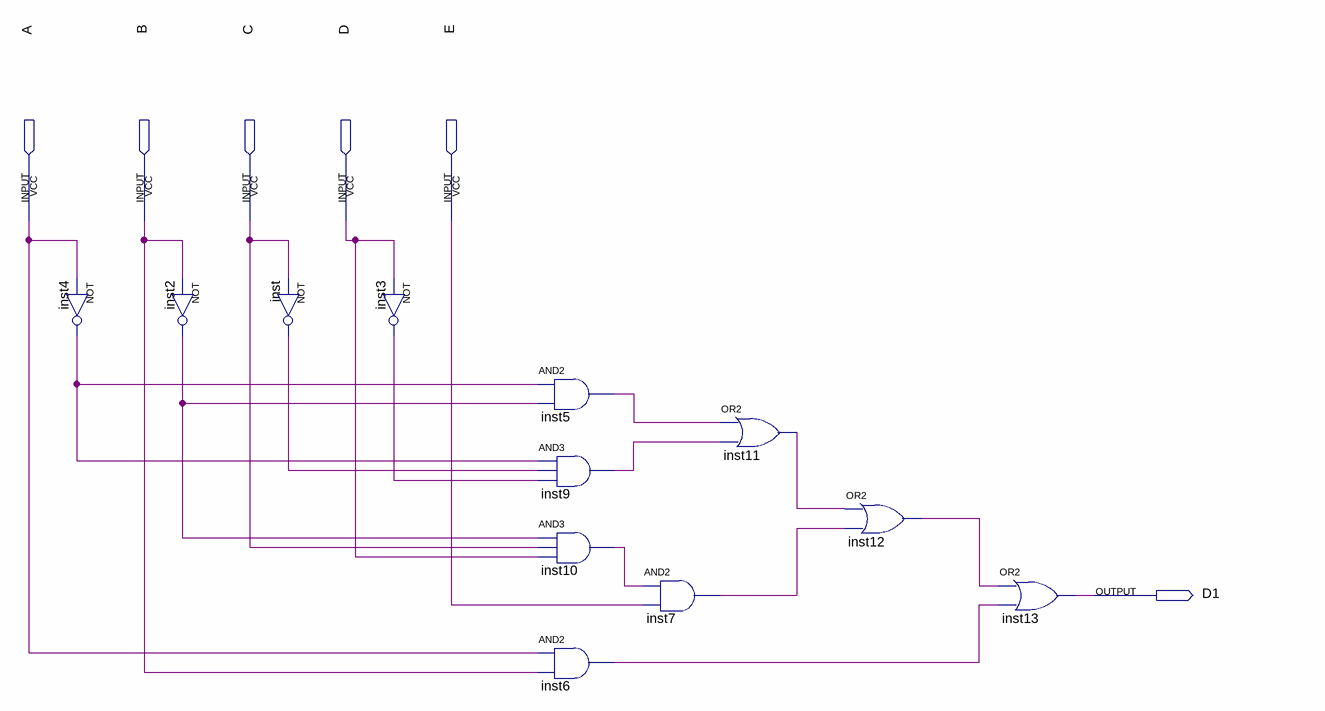
[diagram p0: schematic sheet]
// Quartus schematic led-D1.bdf as structural Verilog: 12 symbols, 6 pins
module \led-D1  (
  input  A,
  input  B,
  input  C,
  input  D,
  input  E,
  output D1
);

  wire inst2_out, inst3_out, inst4_out, inst5_out, inst6_out, inst7_out, inst9_out, inst10_out, inst11_out,
       inst12_out, inst_out;

  not inst4 (inst4_out, A);
  not inst2 (inst2_out, B);
  not inst (inst_out, C);
  not inst3 (inst3_out, D);
  and inst5 (inst5_out, inst4_out, inst2_out);
  and inst9 (inst9_out, inst4_out, inst_out, inst3_out);
  and inst10 (inst10_out, inst2_out, C, D);
  and inst6 (inst6_out, A, B);
  and inst7 (inst7_out, inst10_out, E);
  or inst11 (inst11_out, inst5_out, inst9_out);
  or inst12 (inst12_out, inst11_out, inst7_out);
  or inst13 (D1, inst12_out, inst6_out);
endmodule
